# Altium schematic sheet IO_Filter.SchDoc: IO Filter
size Letter; Engineer: Brandt Buchda; Revision: B; SheetNumber: 4; SheetTotal: 4
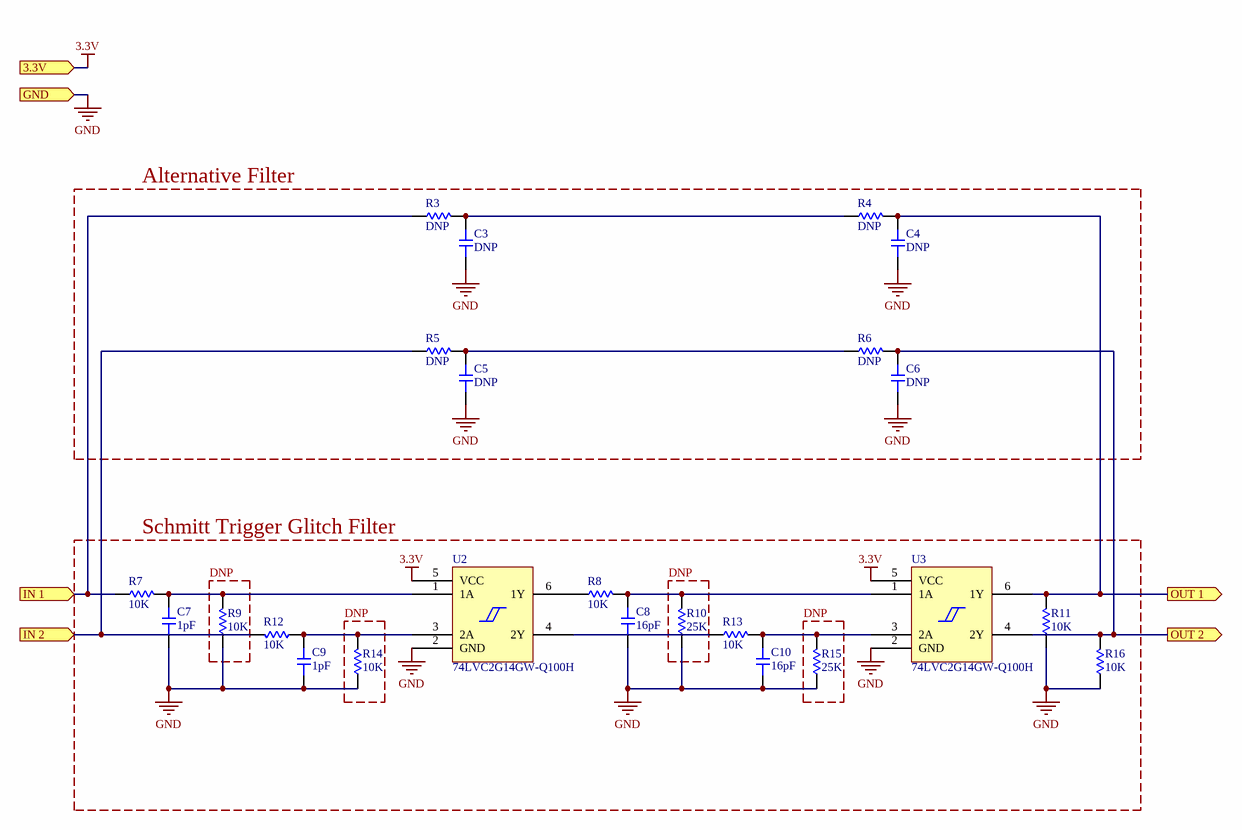
[diagram p0: IO_Filter.SchDoc]

## Parts
C3  DNP  [0603-CAP]  (no BOM)
C4  DNP  [0603-CAP]  (no BOM)
C5  DNP  [0603-CAP]  (no BOM)
C6  DNP  [0603-CAP]  (no BOM)
C7  value 1pF  [0603-CAP]  (hidden comment: CC0603BRNPO9BN1R0)
C8  value 16pF  [0603-CAP]  (hidden comment: CC0603JRNPO9BN160)
C9  value 1pF  [0603-CAP]  (hidden comment: CC0603BRNPO9BN1R0)
C10  value 16pF  [0603-CAP]  (hidden comment: CC0603JRNPO9BN160)
R3  DNP  [0603-RES]  (no BOM)
R4  DNP  [0603-RES]  (no BOM)
R5  DNP  [0603-RES]  (no BOM)
R6  DNP  [0603-RES]  (no BOM)
R7  value 10K  [0603-RES]  (hidden comment: RT0603DRE0710KL)
R8  value 10K  [0603-RES]  (hidden comment: RT0603DRE0710KL)
R9  value 10K  [0603-RES]  (hidden comment: RT0603DRE0710KL)
R10  value 25K  [RESC2012X06N]  (hidden comment: CPF-A-0805B25KE)
R11  value 10K  [0603-RES]  (hidden comment: RT0603DRE0710KL)
R12  value 10K  [0603-RES]  (hidden comment: RT0603DRE0710KL)
R13  value 10K  [0603-RES]  (hidden comment: RT0603DRE0710KL)
R14  value 10K  [0603-RES]  (hidden comment: RT0603DRE0710KL)
R15  value 25K  [RESC2012X06N]  (hidden comment: CPF-A-0805B25KE)
R16  value 10K  [0603-RES]  (hidden comment: RT0603DRE0710KL)
U2  74LVC2G14GW-Q100H  [TSOP65P210X110-6N]
U3  74LVC2G14GW-Q100H  [TSOP65P210X110-6N]

## Blocks framed on the sheet
Alternative Filter: C3-C6 R3-R6
Schmitt Trigger Glitch Filter: C7-C10 R7 R8 R11-R13 R16 U2 U3
DNP: R9
DNP: R10
DNP: R14
DNP: R15

## Ports
3.3V (in), GND (in), IN 1 (in), IN 2 (in), OUT 1 (out), OUT 2 (out)

## Nets
3.3V: U2.5(VCC) U3.5(VCC) ; port 3.3V
GND: C3.1 C4.1 C5.1 C6.1 C7.1 C8.1 C9.1 C10.1 R9.1 R10.1 R11.1 R14.1 R15.1 R16.1 U2.2(GND) U3.2(GND) ; port GND
IN 1: R3.1 R7.1 ; port IN 1
IN 2: R5.1 R12.2 ; port IN 2
OUT 1: C4.2 R4.2 R11.2 U3.6(1Y) ; port OUT 1
OUT 2: C6.2 R6.2 R16.2 U3.4(2Y) ; port OUT 2
NetC3_2: C3.2 R3.2 R4.1
NetC5_2: C5.2 R5.2 R6.1
NetC7_2: C7.2 R7.2 R9.2 U2.1(1A)
NetC8_2: C8.2 R8.2 R10.2 U3.1(1A)
NetC9_2: C9.2 R12.1 R14.2 U2.3(2A)
NetC10_2: C10.2 R13.2 R15.2 U3.3(2A)
NetR8_1: R8.1 U2.6(1Y)
NetR13_1: R13.1 U2.4(2Y)

## Notes on the sheet
- Title:
- File:
- Sheet:
- of
- Revision:
- Time:
- Date:
- Engineer:

## Library data of the parts
C3-C6 = Capacitor: Value: DNP
C7 C9 = Capacitor 1pF: ±0.1pF 50V Ceramic Capacitor C0G, NP0 0603 (1608 Metric); Supplier 1: DigiKey; Supplier Part Number 1: 311-3346-1-ND
C8 C10 = Capacitor 16pF: ±5% 50V Ceramic Capacitor C0G, NP0 0603 (1608 Metric); Supplier 1: DigiKey; Supplier Part Number 1: 311-3964-1-ND
R3-R6 = Resistor: Value: DNP
R7-R9 R11-R14 R16 = Resisitor 10K: 10 ±0.5% 0.1W, 1/10W Chip Resistor 0603 (1608 Metric) - Thin Film; Supplier Part Number 1: YAG2318CT-ND; Supplier 1: DigiKey
R10 R15 = Resistor 25K: 25 ±0.1% 0.1W, 1/10W Chip Resistor 0805 (2012 Metric) Anti-Sulfur, Automotive AEC-Q200, Moisture Resistant Thin Film; Supplier 1: DigiKey; Supplier Part Number 1: 1712-CPF-A-0805B25KECT-ND
U2 U3 = 74LVC2G14GW-Q100H: Inverter IC 2 Channel Schmitt Trigger SOT-363; Supplier 1: DigiKey; Supplier Part Number 1: 1727-2072-1-ND